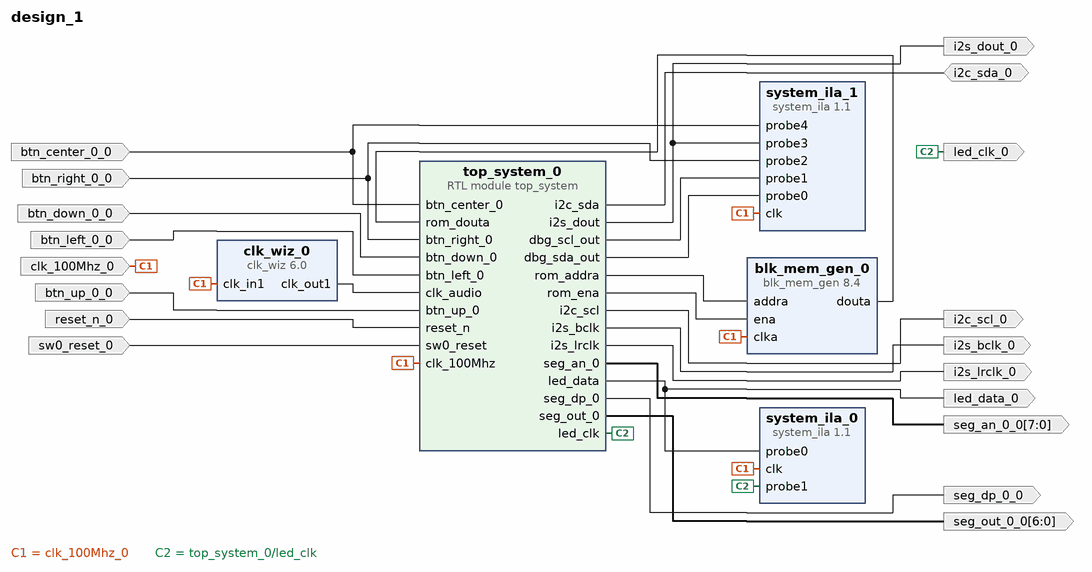
[diagram p0: block diagram of the top level]
# Vivado block design design_1, xc7a100tcsg324-1, Vivado 2025.1
create_bd_design design_1

create_bd_port -dir I clk_100Mhz_0
create_bd_port -dir I -type rst reset_n_0
create_bd_port -dir O -type clk led_clk_0
create_bd_port -dir O led_data_0
create_bd_port -dir O -from 6 -to 0 seg_out_0_0
create_bd_port -dir O -from 7 -to 0 seg_an_0_0
create_bd_port -dir O seg_dp_0_0
create_bd_port -dir I btn_up_0_0
create_bd_port -dir I btn_down_0_0
create_bd_port -dir I btn_left_0_0
create_bd_port -dir I btn_right_0_0
create_bd_port -dir IO i2c_sda_0
create_bd_port -dir I btn_center_0_0
create_bd_port -dir O i2s_bclk_0
create_bd_port -dir O i2s_lrclk_0
create_bd_port -dir O i2s_dout_0
create_bd_port -dir O i2c_scl_0
create_bd_port -dir I -type rst sw0_reset_0

create_bd_cell -type module -reference top_system top_system_0
create_bd_cell -type ip -vlnv xilinx.com:ip:system_ila:1.1 system_ila_0
set_property -dict [list \
  CONFIG.C_DATA_DEPTH 4096 \
  CONFIG.C_MON_TYPE NATIVE \
  CONFIG.C_NUM_OF_PROBES 2 \
  CONFIG.C_PROBE0_TYPE 0 \
] [get_bd_cells system_ila_0]
create_bd_cell -type ip -vlnv xilinx.com:ip:system_ila:1.1 system_ila_1
set_property -dict [list \
  CONFIG.C_DATA_DEPTH 65536 \
  CONFIG.C_MON_TYPE NATIVE \
  CONFIG.C_NUM_OF_PROBES 5 \
  CONFIG.C_PROBE0_TYPE 0 \
  CONFIG.C_PROBE1_TYPE 0 \
] [get_bd_cells system_ila_1]
create_bd_cell -type ip -vlnv xilinx.com:ip:clk_wiz:6.0 clk_wiz_0
set_property -dict [list \
  CONFIG.CLKOUT1_JITTER 360.948 \
  CONFIG.CLKOUT1_PHASE_ERROR 301.601 \
  CONFIG.CLKOUT1_REQUESTED_OUT_FREQ 12.288 \
  CONFIG.CLKOUT2_JITTER 130.958 \
  CONFIG.CLKOUT2_PHASE_ERROR 98.575 \
  CONFIG.CLKOUT2_USED false \
  CONFIG.MMCM_CLKFBOUT_MULT_F 48.000 \
  CONFIG.MMCM_CLKOUT0_DIVIDE_F 78.125 \
  CONFIG.MMCM_CLKOUT1_DIVIDE 1 \
  CONFIG.MMCM_DIVCLK_DIVIDE 5 \
  CONFIG.NUM_OUT_CLKS 1 \
  CONFIG.USE_LOCKED false \
  CONFIG.USE_RESET false \
] [get_bd_cells clk_wiz_0]
create_bd_cell -type ip -vlnv xilinx.com:ip:blk_mem_gen:8.4 blk_mem_gen_0
set_property -dict [list \
  CONFIG.Coe_File ../../../../../../Ludovico-Einaudi-Nuvole-Bianche.coe \
  CONFIG.Load_Init_File true \
  CONFIG.Memory_Type Single_Port_ROM \
  CONFIG.Register_PortA_Output_of_Memory_Primitives false \
  CONFIG.Write_Depth_A 160000 \
  CONFIG.Write_Width_A 24 \
  CONFIG.use_bram_block Stand_Alone \
] [get_bd_cells blk_mem_gen_0]

# ---- connections ----

connect_bd_net [get_bd_ports i2c_sda_0] [get_bd_pins top_system_0/i2c_sda]
connect_bd_net [get_bd_pins blk_mem_gen_0/douta] [get_bd_pins top_system_0/rom_douta]
connect_bd_net -net btn_center_0_0_1 [get_bd_ports btn_center_0_0] [get_bd_pins system_ila_1/probe4] [get_bd_pins top_system_0/btn_center_0]
connect_bd_net -net btn_down_0_0_1 [get_bd_ports btn_down_0_0] [get_bd_pins top_system_0/btn_down_0]
connect_bd_net -net btn_left_0_0_1 [get_bd_ports btn_left_0_0] [get_bd_pins top_system_0/btn_left_0]
connect_bd_net -net btn_right_0_0_1 [get_bd_ports btn_right_0_0] [get_bd_pins system_ila_1/probe2] [get_bd_pins top_system_0/btn_right_0]
connect_bd_net -net btn_up_0_0_1 [get_bd_ports btn_up_0_0] [get_bd_pins top_system_0/btn_up_0]
connect_bd_net -net clk_100Mhz_0_1 [get_bd_ports clk_100Mhz_0] \
  [get_bd_pins system_ila_0/clk] [get_bd_pins system_ila_1/clk] [get_bd_pins clk_wiz_0/clk_in1] \
  [get_bd_pins blk_mem_gen_0/clka] [get_bd_pins top_system_0/clk_100Mhz]
connect_bd_net [get_bd_pins clk_wiz_0/clk_out1] [get_bd_pins top_system_0/clk_audio]
connect_bd_net -net reset_n_0_1 [get_bd_ports reset_n_0] [get_bd_pins top_system_0/reset_n]
connect_bd_net -net sw0_reset_0_1 [get_bd_ports sw0_reset_0] [get_bd_pins top_system_0/sw0_reset]
connect_bd_net -net top_system_0_dbg_scl_out [get_bd_pins top_system_0/dbg_scl_out] [get_bd_pins system_ila_1/probe1]
connect_bd_net -net top_system_0_dbg_sda_out [get_bd_pins top_system_0/dbg_sda_out] [get_bd_pins system_ila_1/probe0]
connect_bd_net [get_bd_pins top_system_0/i2c_scl] [get_bd_ports i2c_scl_0]
connect_bd_net [get_bd_pins top_system_0/i2s_bclk] [get_bd_ports i2s_bclk_0]
connect_bd_net -net top_system_0_i2s_dout [get_bd_pins top_system_0/i2s_dout] [get_bd_ports i2s_dout_0] [get_bd_pins system_ila_1/probe3]
connect_bd_net [get_bd_pins top_system_0/i2s_lrclk] [get_bd_ports i2s_lrclk_0]
connect_bd_net [get_bd_pins top_system_0/led_clk] [get_bd_ports led_clk_0] [get_bd_pins system_ila_0/probe1]
connect_bd_net -net top_system_0_led_data [get_bd_pins top_system_0/led_data] [get_bd_ports led_data_0] [get_bd_pins system_ila_0/probe0]
connect_bd_net [get_bd_pins top_system_0/rom_addra] [get_bd_pins blk_mem_gen_0/addra]
connect_bd_net [get_bd_pins top_system_0/rom_ena] [get_bd_pins blk_mem_gen_0/ena]
connect_bd_net [get_bd_pins top_system_0/seg_an_0] [get_bd_ports seg_an_0_0]
connect_bd_net [get_bd_pins top_system_0/seg_dp_0] [get_bd_ports seg_dp_0_0]
connect_bd_net [get_bd_pins top_system_0/seg_out_0] [get_bd_ports seg_out_0_0]
set_property HDL_ATTRIBUTE.DEBUG true [get_bd_nets btn_center_0_0_1]
set_property HDL_ATTRIBUTE.MARK_DEBUG true [get_bd_nets btn_center_0_0_1]
set_property HDL_ATTRIBUTE.DEBUG true [get_bd_nets top_system_0_dbg_scl_out]
set_property HDL_ATTRIBUTE.MARK_DEBUG true [get_bd_nets top_system_0_dbg_scl_out]
set_property HDL_ATTRIBUTE.DEBUG true [get_bd_nets top_system_0_dbg_sda_out]
set_property HDL_ATTRIBUTE.MARK_DEBUG true [get_bd_nets top_system_0_dbg_sda_out]
set_property HDL_ATTRIBUTE.DEBUG true [get_bd_nets top_system_0_i2s_dout]
set_property HDL_ATTRIBUTE.MARK_DEBUG true [get_bd_nets top_system_0_i2s_dout]
set_property HDL_ATTRIBUTE.DEBUG true [get_bd_nets top_system_0_led_data]
set_property HDL_ATTRIBUTE.MARK_DEBUG true [get_bd_nets top_system_0_led_data]

validate_bd_design
save_bd_design
